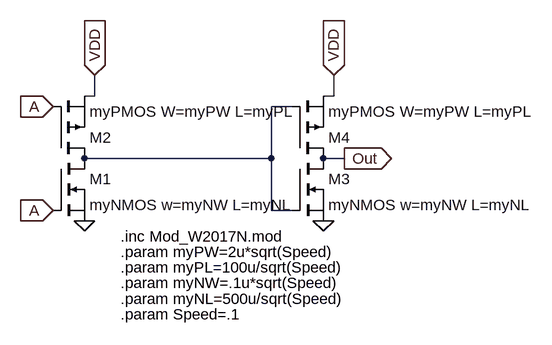
[diagram p0: schematic Gate_Delay.asc]
Gate_Delay.asc, the LTspice schematic file:
Version 4
SHEET 1 880 680
WIRE -384 -80 -384 -112
WIRE -384 -80 -400 -80
WIRE -16 -80 -16 -112
WIRE -16 -80 -32 -80
WIRE -80 -64 -112 -64
WIRE -112 16 -112 -64
WIRE -112 16 -400 16
WIRE 0 16 -32 16
WIRE -112 96 -112 16
WIRE -80 96 -112 96
FLAG -384 -112 VDD
IOPIN -384 -112 In
FLAG -400 112 0
FLAG -448 -64 A
IOPIN -448 -64 In
FLAG -448 96 A
IOPIN -448 96 In
FLAG -16 -112 VDD
IOPIN -16 -112 In
FLAG -32 112 0
FLAG 0 16 Out
IOPIN 0 16 Out
SYMBOL nmos -448 16 R0
SYMATTR InstName M1
SYMATTR Value myNMOS w=myNW L=myNL
SYMBOL pmos -448 16 M180
SYMATTR InstName M2
SYMATTR Value myPMOS W=myPW L=myPL
SYMBOL nmos -80 16 R0
SYMATTR InstName M3
SYMATTR Value myNMOS w=myNW L=myNL
SYMBOL pmos -80 16 M180
SYMATTR InstName M4
SYMATTR Value myPMOS W=myPW L=myPL
TEXT -344 136 Left 2 !.inc Mod_W2017N.mod
TEXT -344 160 Left 2 !.param myPW=2u*sqrt(Speed)
TEXT -344 184 Left 2 !.param myPL=100u/sqrt(Speed)
TEXT -344 208 Left 2 !.param myNW=.1u*sqrt(Speed)
TEXT -344 232 Left 2 !.param myNL=500u/sqrt(Speed)
TEXT -344 256 Left 2 !.param Speed=.1

The netlist it stands for:
* Gate_Delay.asc
M1 N001 A 0 0 myNMOS w=myNW L=myNL
M2 N001 A VDD VDD myPMOS W=myPW L=myPL
M3 Out N001 0 0 myNMOS w=myNW L=myNL
M4 Out N001 VDD VDD myPMOS W=myPW L=myPL
.model NMOS NMOS
.model PMOS PMOS
.lib standard.mos
.inc Mod_W2017N.mod
.param myPW=2u*sqrt(Speed)
.param myPL=100u/sqrt(Speed)
.param myNW=.1u*sqrt(Speed)
.param myNL=500u/sqrt(Speed)
.param Speed=.1
.backanno
.end